# EAGLE design controller-board (EAGLE 9.1.3)
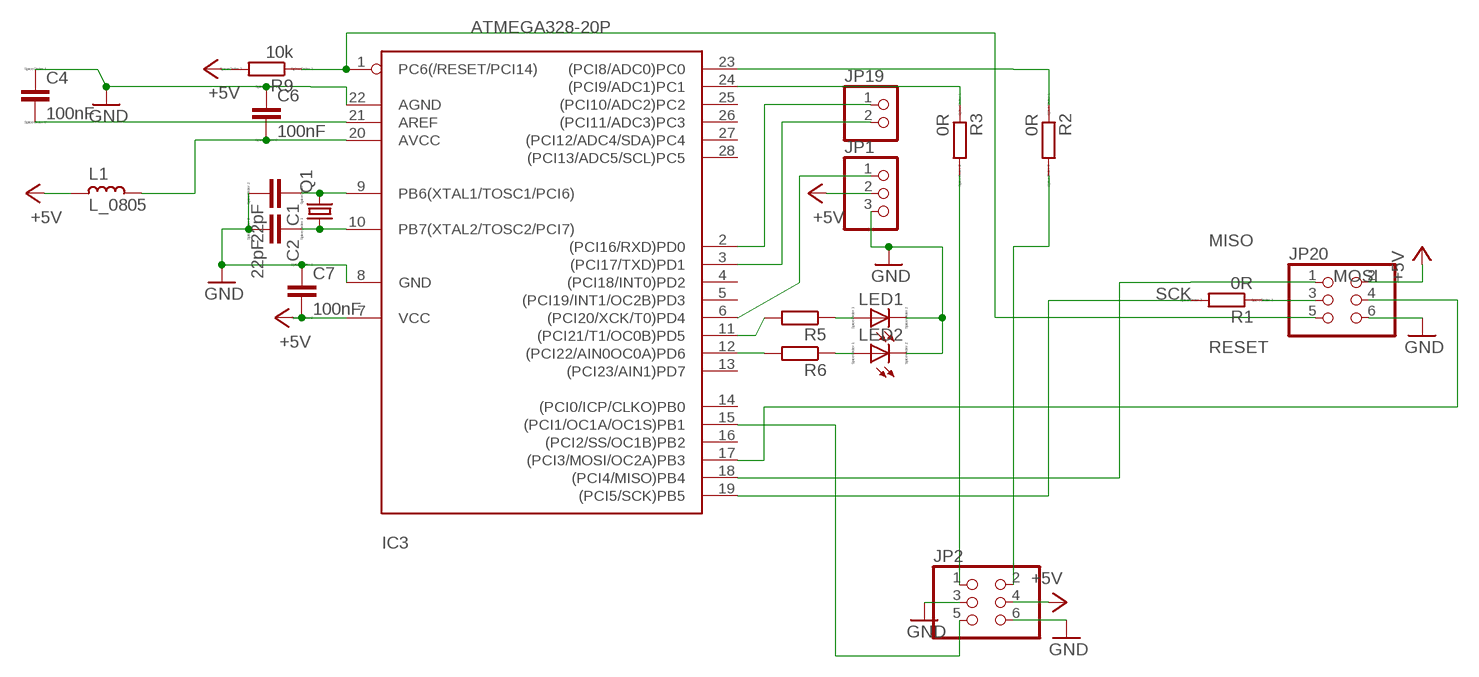
[diagram p0: schematic, sheet 1]

## Parts
C1  22pF  CC1206  [C1206]
C2  22pF  CC1206  [C1206]
C4  100nF  CC1206  [C1206]
C6  100nF  CC1206  [C1206]
C7  100nF  CC1206  [C1206]
IC3  ATMEGA328-20P  [DIL28-3]
JP1  PINHD-1X3  [1X03]
JP2  PINHD-2X3  [2X03]
JP19  PINHD-1X2  [1X02]
JP20  PINHD-2X3  [2X03]
L1  L_0805  [L0805]
LED1  LED_E  [LED_1206]
LED2  LED_E  [LED_1206]
Q1  CRYSTALHC49U-V  [HC49U-V]
R1  0R  RR1206  [R1206]
R2  0R  RR1206  [R1206]
R3  0R  RR1206  [R1206]
R5  R-EU_R1206  [R1206]
R6  R-EU_R1206  [R1206]
R9  10k  RR1206  [R1206]

## Nets
+5V: C7.2 IC3.7(VCC) JP1.2 JP2.4 JP20.2 L1.2 R9.2
GND: C1.2 C2.2 C4.1 C6.1 C7.1 IC3.8(GND) IC3.22(AGND) JP1.3 JP2.3 JP2.6 JP20.6 LED1.C LED2.C
MISO: IC3.18((PCI4/MISO)PB4) JP20.1
MOSI: IC3.17((PCI3/MOSI/OC2A)PB3) JP20.4
N$1: IC3.24((PCI9/ADC1)PC1) R3.1
N$2: IC3.23((PCI8/ADC0)PC0) R2.1
N$3: C1.1 IC3.9(PB6(XTAL1/TOSC1/PCI6)) Q1.2
N$4: C2.1 IC3.10(PB7(XTAL2/TOSC2/PCI7)) Q1.1
N$5: JP20.3 R1.1
N$6: JP2.2 R2.2
N$7: JP2.1 R3.2
N$17: IC3.2((PCI16/RXD)PD0) JP19.1
N$18: IC3.3((PCI17/TXD)PD1) JP19.2
N$19: IC3.11((PCI21/T1/OC0B)PD5) R5.2
N$20: LED1.A R5.1
N$21: LED2.A R6.1
N$22: IC3.12((PCI22/AIN0OC0A)PD6) R6.2
N$34: IC3.15((PCI1/OC1A/OC1S)PB1) JP2.5
N$43: C4.2 IC3.21(AREF)
N$46: C6.2 IC3.20(AVCC) L1.1
N$47: IC3.6((PCI20/XCK/T0)PD4) JP1.1
RESET: IC3.1(PC6(/RESET/PCI14)) JP20.5 R9.1
SCK: IC3.19((PCI5/SCK)PB5) R1.2
Unconnected: IC3.4((PCI18/INT0)PD2) IC3.5((PCI19/INT1/OC2B)PD3) IC3.13((PCI23/AIN1)PD7) IC3.14((PCI0/ICP/CLKO)PB0) IC3.16((PCI2/SS/OC1B)PB2) IC3.25((PCI10/ADC2)PC2) IC3.26((PCI11/ADC3)PC3) IC3.27((PCI12/ADC4/SDA)PC4) IC3.28((PCI13/ADC5/SCL)PC5)

## Library data of the parts
C1 C2 C4 C6 C7 = eagle-ltspice:C: CAPACITOR, European symbol; SPICEMODEL: NONE; SPICEPREFIX: C
IC3 = atmega328:ATMEGA328*P: MICROCONTROLLER 32 kBytes FLASH 2 kBytes SRAM 1 kBytes EEPROM USART 8-channel 10 bit ADC
JP1 = pinhead:PINHD-1X3: PIN HEADER
JP2 JP20 = pinhead:PINHD-2X3: PIN HEADER
JP19 = pinhead:PINHD-1X2: PIN HEADER
L1 = rc-master-smd:L_: INDUCTOR
LED1 LED2 = eagle-ltspice:LED_E: LED Source: http://www.osram.convergy.de Source: www.luxeon.com Source: www.kingbright.com; SPICEMODEL: NONE; SPICEPREFIX: D; SPICETYPE: diode
Q1 = crystal:CRYSTAL: CRYSTAL; OC_FARNELL: 1666969; OC_NEWARK: unknown
R1-R3 R9 = eagle-ltspice:R: RESISTOR, European symbol; SPICEMODEL: NONE; SPICEPREFIX: R
R5 R6 = resistor:R-EU_: RESISTOR, European symbol

## Net classes
0 default: width 0.406 mm

## Board
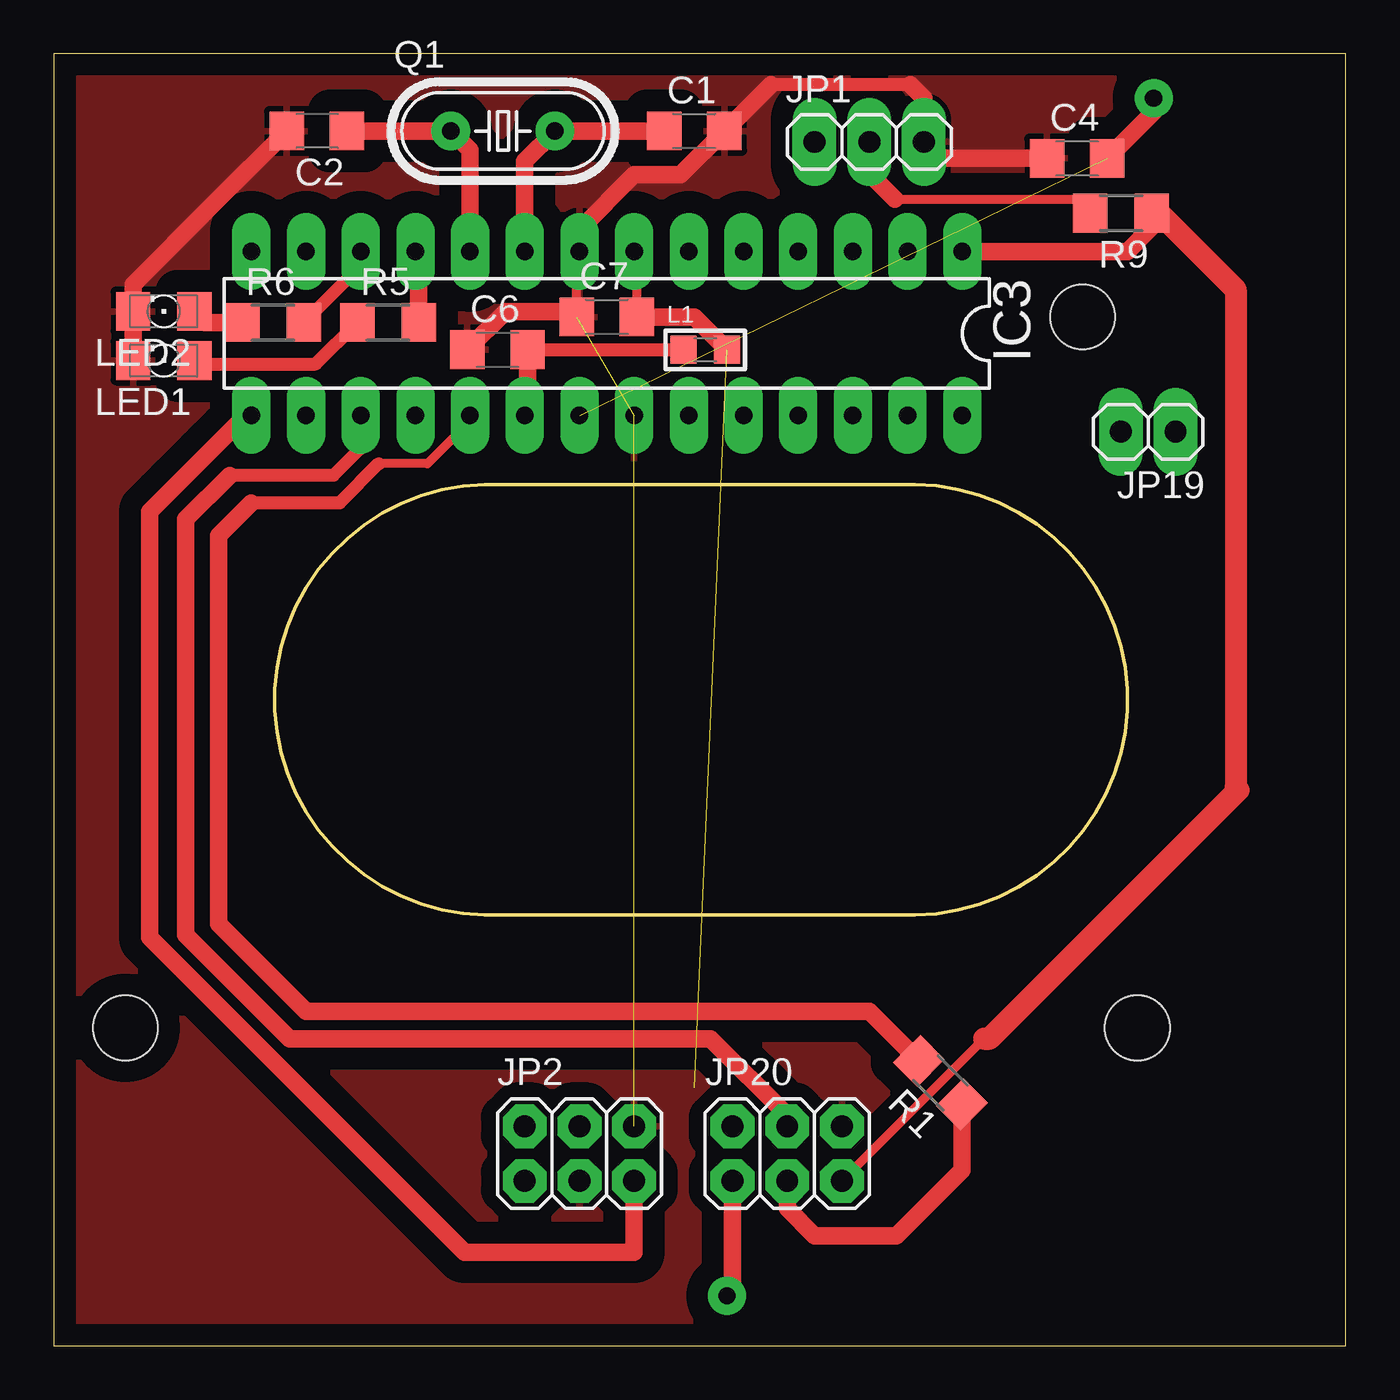
[diagram p1: board, top side]
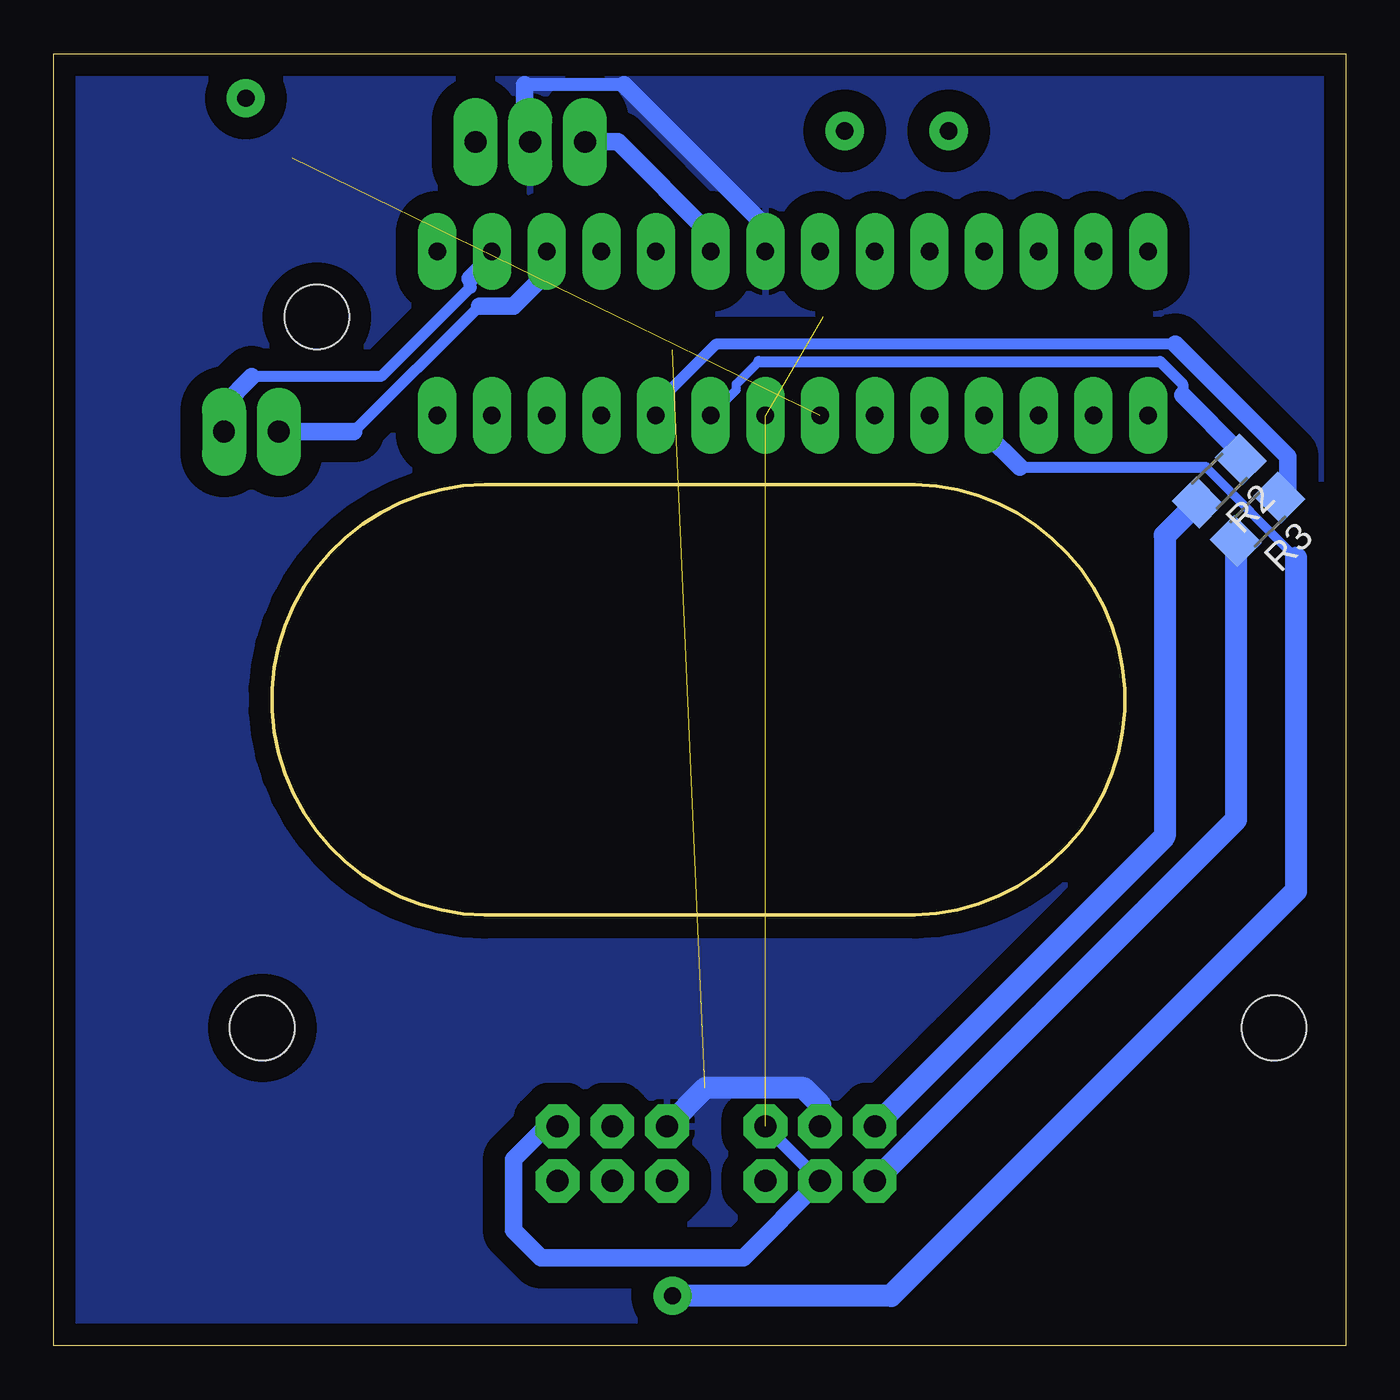
[diagram p2: board, bottom side, seen from below]

Size 60 x 60 mm. Coordinates in mm from the lower left corner, seen from the top.
Outline: 0,0 60,0 60,60 0,60 0,0
Outline: 20,40 40,40 arc-179 40,20 20,20 arc-177 20,40
Copper layers (1*16): Top 0.035mm / dielectric 1.5mm / Bottom 0.035mm
Design rules "rucni": minimum track width 10mil, minimum drill 0.8mm, track to track 10mil, track to pad 10mil, pad to pad 10mil, via to via 10mil, smd to smd 10mil, copper to edge 40mil, drill to drill 10mil, minimum pad ring 10mil, minimum via ring 8mil, stop-mask expansion 4mil, vias tented up to drill 0mil, thermal gap 10mil
Holes 3 mm at 3.33,14.76 50.32,14.76 47.78,47.78

### Footprints (pad centres in the part's own frame; a part is rotated, then mirrored left to right if it is on the bottom)
C1206 = smd 1.6 x 1.8: 1 -1.4,0; 2 1.4,0
DIL28-3 = drill 0.813 long: 1 -16.51,-3.81; 2 -13.97,-3.81; 3 -11.43,-3.81; 4 -8.89,-3.81; 5 -6.35,-3.81; 6 -3.81,-3.81; 7 -1.27,-3.81; 8 1.27,-3.81; 9 3.81,-3.81; 10 6.35,-3.81; 11 8.89,-3.81; 12 11.43,-3.81; 13 13.97,-3.81; 14 16.51,-3.81; 15 16.51,3.81; 16 13.97,3.81; 17 11.43,3.81; 18 8.89,3.81; 19 6.35,3.81; 20 3.81,3.81; 21 1.27,3.81; 22 -1.27,3.81; 23 -3.81,3.81; 24 -6.35,3.81; 25 -8.89,3.81; 26 -11.43,3.81; 27 -13.97,3.81; 28 -16.51,3.81
1X03 = drill 1.016 long: 1 -2.54,0; 2 0,0; 3 2.54,0
2X03 = drill 1.016 octagon: 1 -2.54,-1.27; 2 -2.54,1.27; 3 0,-1.27; 4 0,1.27; 5 2.54,-1.27; 6 2.54,1.27
1X02 = drill 1.016 long: 1 -1.27,0; 2 1.27,0
L0805 = smd 1.2 x 1.3: 1 -1.016,0; 2 1.016,0
LED_1206 = smd 1.6 x 1.803: A -1.422,0; C 1.422,0
HC49U-V = drill 0.813: 1 -2.413,0; 2 2.413,0
R1206 = smd 1.6 x 1.803: 1 -1.422,0; 2 1.422,0

### Placement (x,y rotation side)
C1  29.75,56.42 0 top
C2  12.22,56.42 180 top
C4  47.53,55.15 0 top
C6  20.6,46.26 0 top
C7  25.68,47.78 0 top
IC3  25.68,47.02 180 top
JP1  37.87,55.91 0 top
JP2  24.41,8.92 0 top
JP19  50.83,42.45 180 top
JP20  34.06,8.92 0 top
L1  30.25,46.26 0 top
LED1  5.11,45.75 180 top
LED2  5.11,48.03 180 top
Q1  20.86,56.42 0 top
R1  41.18,12.22 135 top
R2  5.87,40.16 225 bottom
R3  4.09,38.38 225 bottom
R5  15.52,47.53 0 top
R6  10.19,47.53 0 top
R9  49.56,52.61 180 top

### Tracks (layer width: path | path; a pad name or v marks a point on that pad's centre or on a via)
+5V  (1 unrouted)
  Top 0.406: 39.06,53.25 48.14,53.25 R9.2 | C7.2 27.08,50.7 IC3.7
  Top 0.813: L1.2 29.75,47.78 C7.2 | 39.06,53.25 37.87,54.44 JP1.2
  Bottom 0.406: 38.13,56.16 JP1.2
  Bottom 0.61: 33.53,58.58 38.13,58.58
  Bottom 0.813: 33.53,58.58 26.95,52 IC3.7 | 38.13,58.58 38.13,56.16
  Bottom 1.016: JP2.4 24.41,11.2 25.17,11.97 29.75,11.97 JP20.2
  pour Bottom (isolate 1.016): 0.03,-0.23 59.97,-0.23 59.97,59.97 0.03,59.97
GND  (2 unrouted)
  Top 0.406: 24.41,51.84 IC3.8 24.28,50.7 C7.1
  Top 0.61: 39.78,58.58 33.3,58.58
  Top 0.813: 39.78,58.58 40.41,57.94 JP1.3 41.18,55.15 C4.1 | 24.41,51.84 26.95,54.38 29.11,54.38 C1.2 33.3,58.58 | C6.1 20.98,48.03 24.03,48.03 C7.1 | C2.2 7.46,53.05 3.69,49.28 LED2.C LED1.C
  Bottom 0.61: JP2.3 JP2.6
  Bottom 0.813: JP2.3 27.97,4.09 37.37,4.09 38.64,5.36 38.64,8.66 37.11,10.19 JP20.6
  pour Top (isolate 1.016): 0.03,0.03 60.23,0.03 60.23,59.97 0.03,59.97
MISO  (via drill 0.8)
  Top 0.406: 31.52,2.57 v31.27,2.31
  Top 0.813: JP20.1 31.52,2.57
  Bottom 0.406: 6.5,40.8 2.31,36.6
  Bottom 0.508: 15.14,40.8 6.5,40.8
  Bottom 0.813: 15.14,40.8 16.79,42.45 IC3.18
  Bottom 1.016: 2.31,36.6 2.31,21.11 21.11,2.31 v31.27,2.31
MOSI
  Top 0.406: 34.06,10.7 JP20.4
  Top 0.61: IC3.17 14.25,41.68 12.98,40.41 8.16,40.41
  Top 0.813: 8.16,40.41 6.12,38.38 6.12,19.08 10.95,14.25 30.51,14.25 34.06,10.7
N$1
  Bottom 0.406: 32.03,43.73 IC3.24
  Bottom 0.508: 32.03,43.73 29.25,46.51 7.92,46.51
  Bottom 0.813: 7.92,46.51 2.7,41.28 2.7,39.78 R3.1
N$2
  Bottom 0.406: 27.26,45.71 28.3,44.66 28.3,44.4 IC3.23 | 4.86,41.44 R2.1
  Bottom 0.508: 7.57,44.14 7.57,44.66 8.61,45.71 27.26,45.71
  Bottom 0.813: 7.57,44.14 4.86,41.44
N$3
  Top 0.813: C1.1 Q1.2 21.87,55.02 IC3.9
N$4
  Top 0.813: C2.1 Q1.1 19.33,55.53 IC3.10
N$5
  Top 0.813: R1.1 42.18,8.15 39.14,5.11 35.33,5.11 34.06,6.38 JP20.3
N$6
  Bottom 1.016: JP2.2 8.4,23.66 8.4,37.63 R2.2
N$7
  Bottom 1.016: R3.2 5.1,24.42 JP2.1
N$17
  Bottom 0.406: 39.65,50.57 IC3.2
  Bottom 0.508: 40.66,49.15 44.8,45.01 50.8,45.01
  Bottom 0.61: 40.66,49.15 40.66,49.56
  Bottom 0.813: 50.8,45.01 52.1,43.72 JP19.1 | 40.66,49.56 39.65,50.57
N$18
  Bottom 0.508: 40.23,48.29 46.07,42.45
  Bottom 0.813: IC3.3 37.11,49.81 38.64,48.29 40.23,48.29 | 46.07,42.45 JP19.2
N$19
  Top 0.406: 16.94,50.68 IC3.11
  Top 0.813: R5.2 16.94,50.68
N$20
  Top 0.406: LED1.A 6.68,45.6
  Top 0.61: 6.68,45.6 12.17,45.6 R5.1
N$21
  Top 0.406: 7.04,47.53 LED2.A
  Top 0.813: R6.1 7.04,47.53
N$22
  Top 0.61: R6.2 14.25,50.17 IC3.12
N$34
  Top 0.61: IC3.15 8.92,43.21
  Top 0.813: JP2.5 26.95,4.35 19.08,4.35 4.46,18.96 4.46,38.75 8.92,43.21
N$43  (via drill 0.8)  (1 unrouted)
  Top 0.813: C4.2 51.08,57.3 v51.08,57.94
N$46
  Top 0.406: IC3.20 22,43.34
  Top 0.61: C6.2 L1.1
  Top 0.813: 22,43.34 C6.2
N$47
  Bottom 0.813: JP1.1 33.8,55.91 29.49,51.6 IC3.6
RESET
  Top 0.406: JP20.5 43.21,14.25 | 51.34,52.61 R9.1 50.98,51.94 | 42.2,50.82 IC3.1
  Top 0.813: 42.2,50.82 49.86,50.82 50.98,51.94
  Top 1.016: 43.21,14.25 43.46,14.25 55.02,25.81 54.89,25.94 54.89,49.05 51.34,52.61
SCK
  Top 0.406: 15.1,40.96 17.35,40.96 19.33,42.94 IC3.19
  Top 0.61: 9.17,39.14 13.28,39.14 15.1,40.96
  Top 0.813: 9.17,39.14 7.65,37.62 7.65,19.59 11.71,15.52 37.87,15.52 R1.2